# Altium schematic sheet Main.SchDoc
size A4; SheetNumber: 1; SheetTotal: 2
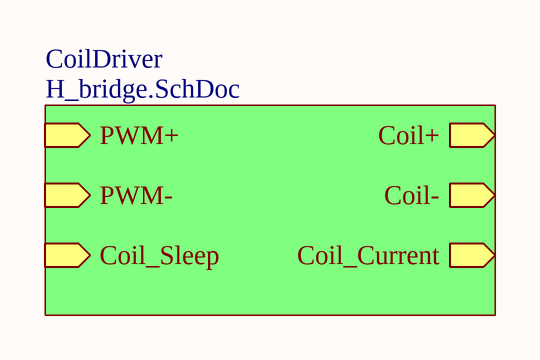
[diagram p0: Main.SchDoc]

## Sub-sheets
CoilDriver = H_bridge.SchDoc: PWM+ (in), PWM- (in), Coil_Sleep (in), Coil+ (out), Coil- (out), Coil_Current (out)